# EAGLE design Car (EAGLE 6.2)
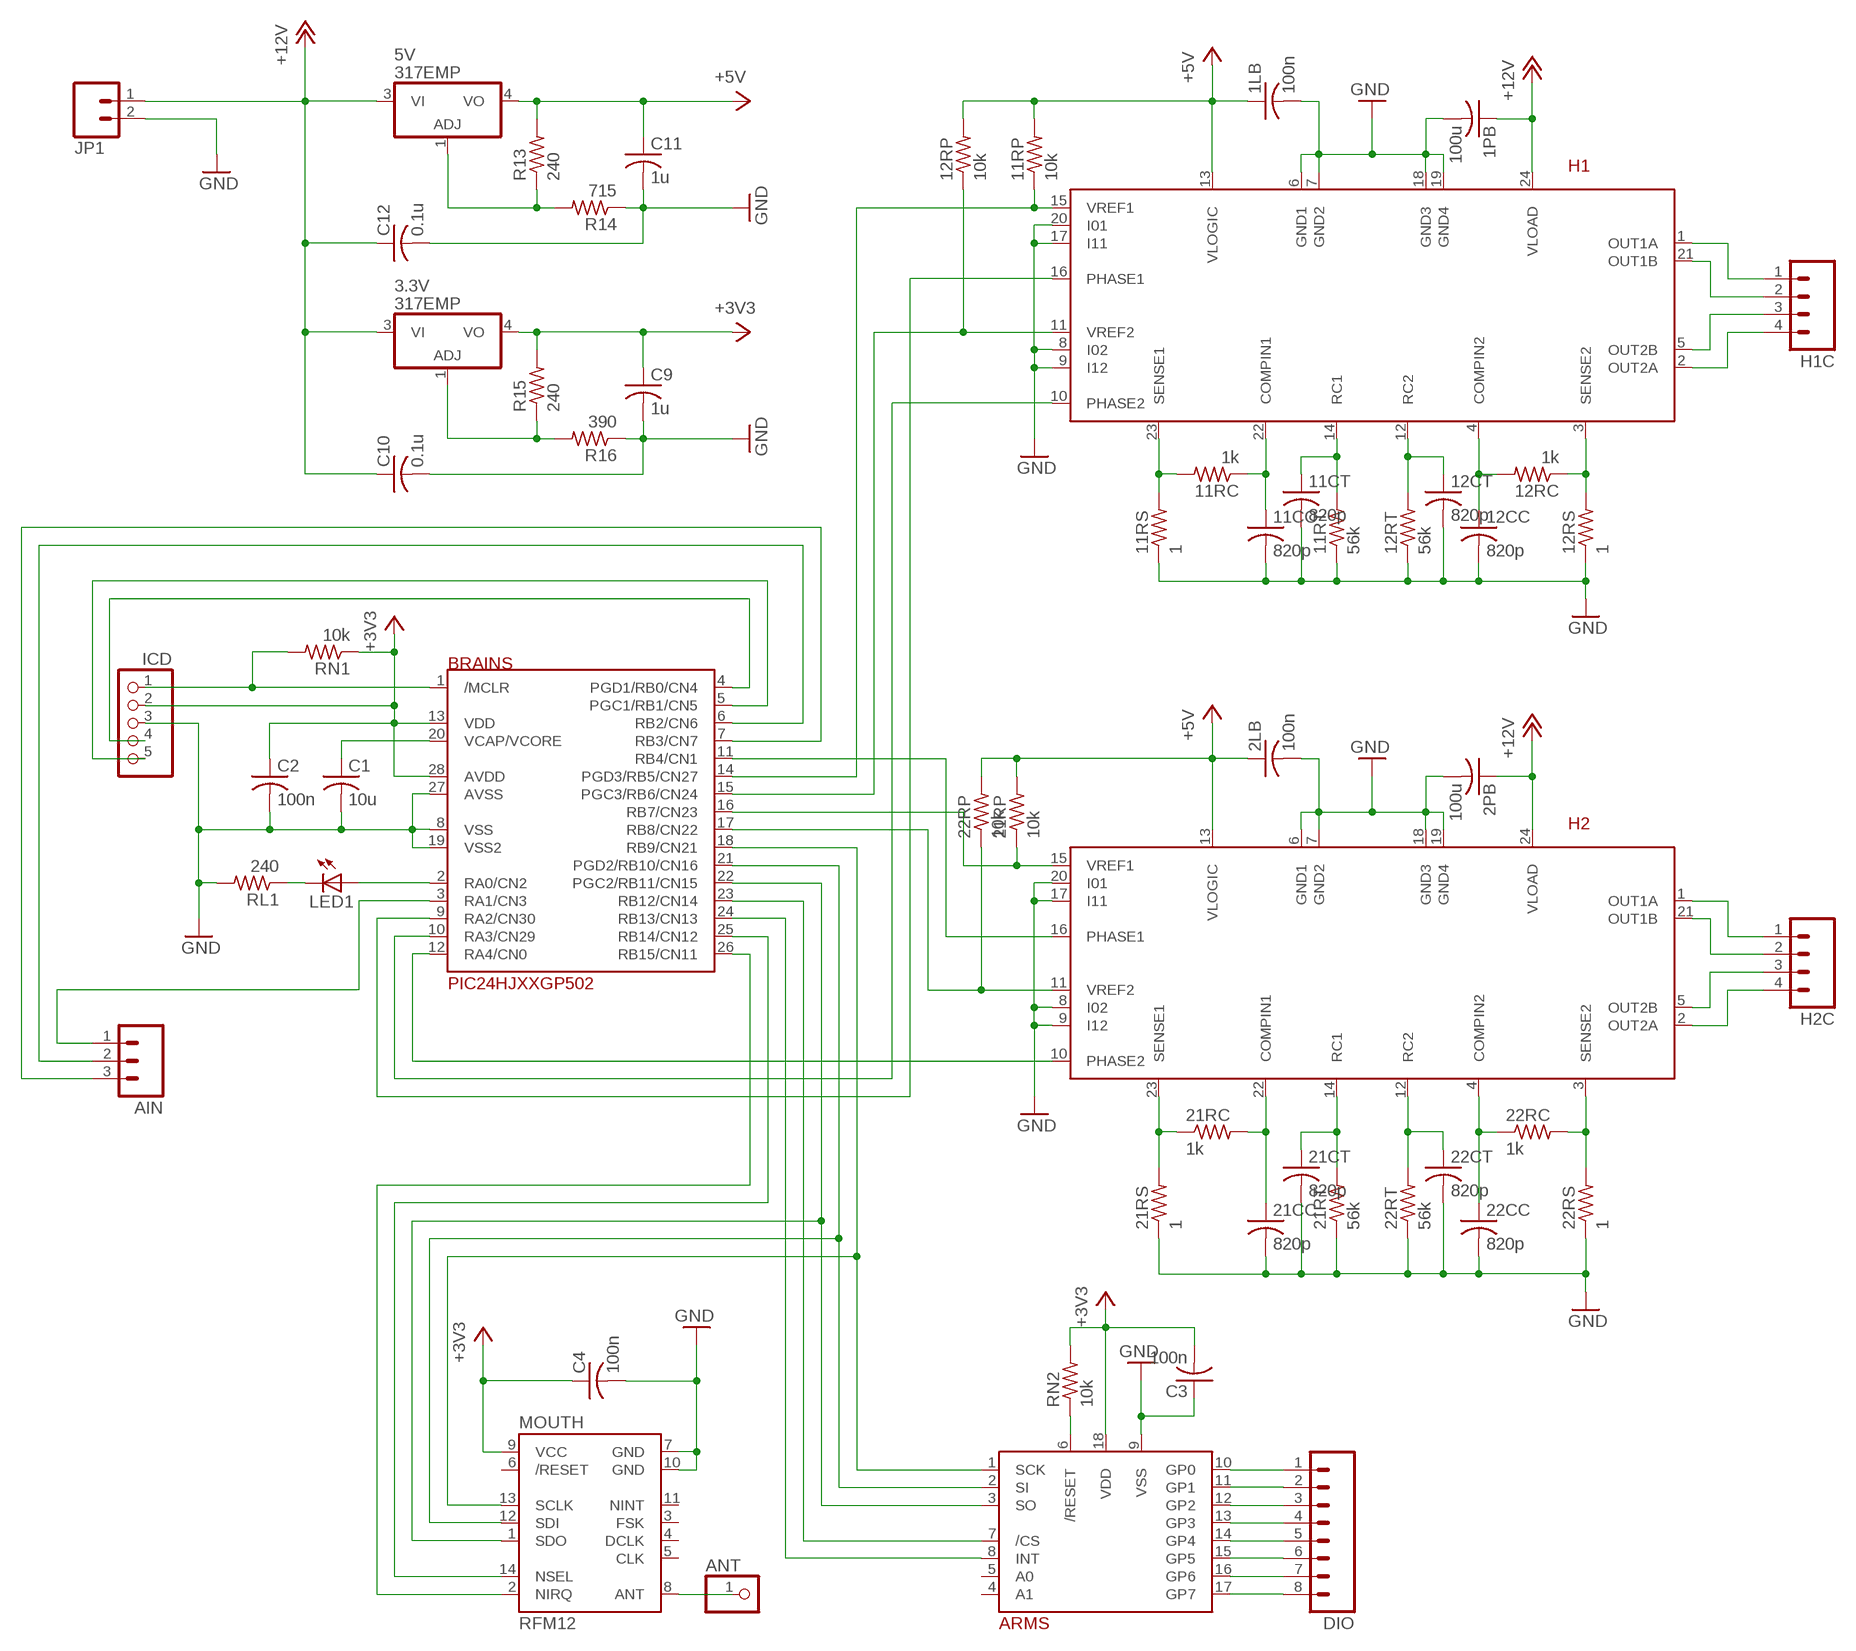
[diagram p0: schematic, sheet 1]

## Parts
1LB  100n  C-USC0805  [C0805]
1PB  100u  C-USC0805  [C0805]
2LB  100n  C-USC0805  [C0805]
2PB  100u  C-USC0805  [C0805]
3.3V  317EMP  [SOT223]
5V  317EMP  [SOT223]
11CC  820p  C-USC0805  [C0805]
11CT  820p  C-USC0805  [C0805]
11RC  1k  R-US_R0805  [R0805]
11RP  10k  R-US_R0805  [R0805]
11RS  1  R-US_R2512  [R2512]
11RT  56k  R-US_R0805  [R0805]
12CC  820p  C-USC0805  [C0805]
12CT  820p  C-USC0805  [C0805]
12RC  1k  R-US_R0805  [R0805]
12RP  10k  R-US_R0805  [R0805]
12RS  1  R-US_R2512  [R2512]
12RT  56k  R-US_R0805  [R0805]
21CC  820p  C-USC0805  [C0805]
21CT  820p  C-USC0805  [C0805]
21RC  1k  R-US_R0805  [R0805]
21RP  10k  R-US_R0805  [R0805]
21RS  1  R-US_R2512  [R2512]
21RT  56k  R-US_R0805  [R0805]
22CC  820p  C-USC0805  [C0805]
22CT  820p  C-USC0805  [C0805]
22RC  1k  R-US_R0805  [R0805]
22RP  10k  R-US_R0805  [R0805]
22RS  1  R-US_R2512  [R2512]
22RT  56k  R-US_R0805  [R0805]
AIN  M03POLAR  [MOLEX-1X3]
ANT  PINHD-1X1  [1X01]
ARMS  MCP23S08  [SO-18W]
BRAINS  PIC24HJXXGP502  [SO28W]
C1  10u  C-USC0805  [C0805]
C2  100n  C-USC0805  [C0805]
C3  100n  C-USC0805  [C0805]
C4  100n  C-USC0805  [C0805]
C9  1u  C-USC0805  [C0805]
C10  0.1u  C-USC0805  [C0805]
C11  1u  C-USC0805  [C0805]
C12  0.1u  C-USC0805  [C0805]
DIO  M081X08  [1X08]
H1  MTS62C19A  [SOP24L]
H1C  M04POLAR  [MOLEX-1X4]
H2  MTS62C19A  [SOP24L]
H2C  M04POLAR  [MOLEX-1X4]
ICD  PINHD-1X5  [1X05]
JP1  M02POLAR  [MOLEX-1X2]
LED1  LEDCHIP-LED0805  [CHIP-LED0805]
MOUTH  RFM12  [RFM12-XXX-S2]
R13  240  R-US_R0805  [R0805]
R14  715  R-US_R0805  [R0805]
R15  240  R-US_R0805  [R0805]
R16  390  R-US_R0805  [R0805]
RL1  240  R-US_R0805  [R0805]
RN1  10k  R-US_R0805  [R0805]
RN2  10k  R-US_R0805  [R0805]

## Nets
+3V3 [power]: 3.3V.4(VO) ARMS.18(VDD) BRAINS.13(VDD) BRAINS.28(AVDD) C2.1 C3.2 C4.1 C9.1 ICD.2 MOUTH.9(VCC) R15.2 RN1.1 RN2.2
+5V [power]: 1LB.1 2LB.1 5V.4(VO) 11RP.2 12RP.2 21RP.2 22RP.2 C11.1 H1.13(VLOGIC) H2.13(VLOGIC) R13.2
+12V [power]: 1PB.1 2PB.1 3.3V.3(VI) 5V.3(VI) C10.1 C12.1 H1.24(VLOAD) H2.24(VLOAD) JP1.1
GND [power]: 1LB.2 1PB.2 2LB.2 2PB.2 11CC.2 11CT.2 11RS.1 11RT.1 12CC.2 12CT.2 12RS.1 12RT.1 21CC.2 21CT.2 21RS.1 21RT.1 22CC.2 22CT.2 22RS.1 22RT.1 ARMS.9(VSS) BRAINS.8(VSS) BRAINS.19(VSS2) BRAINS.27(AVSS) C1.2 C2.2 C3.1 C4.2 C9.2 C10.2 C11.2 C12.2 H1.6(GND1) H1.7(GND2) H1.8(I02) H1.9(I12) H1.17(I11) H1.18(GND3) H1.19(GND4) H1.20(I01) H2.6(GND1) H2.7(GND2) H2.8(I02) H2.9(I12) H2.17(I11) H2.18(GND3) H2.19(GND4) H2.20(I01) ICD.3 JP1.2 MOUTH.7(GND) MOUTH.10(GND) R14.1 R16.1 RL1.2
N$1 [power]: H1.21(OUT1B) H1C.2
N$2 [power]: H1.1(OUT1A) H1C.1
N$3: BRAINS.4(PGD1/RB0/CN4) ICD.4
N$4 [power]: H1.5(OUT2B) H1C.3
N$5 [power]: H1.2(OUT2A) H1C.4
N$6 [power]: H2.21(OUT1B) H2C.2
N$7: ARMS.1(SCK) BRAINS.18(RB9/CN21) MOUTH.13(SCLK)
N$8 [power]: H2.1(OUT1A) H2C.1
N$9 [power]: H2.5(OUT2B) H2C.3
N$10 [power]: H2.2(OUT2A) H2C.4
N$11: BRAINS.1(/MCLR) ICD.1 RN1.2
N$12: ARMS.16(GP6) DIO.7
N$13 [power]: 21RC.1 21RS.2 H2.23(SENSE1)
N$14: 21CC.1 21RC.2 H2.22(COMPIN1)
N$15: 22CT.1 22RT.2 H2.12(RC2)
N$16 [power]: 22RC.2 22RS.2 H2.3(SENSE2)
N$17: 22CC.1 22RC.1 H2.4(COMPIN2)
N$18: 21CT.1 21RT.2 H2.14(RC1)
N$19: 22RP.1 BRAINS.17(RB8/CN22) H2.11(VREF2)
N$20: 3.3V.1(ADJ) R15.1 R16.2
N$21: 12RP.1 BRAINS.15(PGC3/RB6/CN24) H1.11(VREF2)
N$22: BRAINS.25(RB14/CN12) MOUTH.14(NSEL)
N$23: BRAINS.11(RB4/CN1) H2.16(PHASE1)
N$24: BRAINS.26(RB15/CN11) MOUTH.2(NIRQ)
N$25: ARMS.2(SI) BRAINS.21(PGD2/RB10/CN16) MOUTH.12(SDI)
N$26: ARMS.3(SO) BRAINS.22(PGC2/RB11/CN15) MOUTH.1(SDO)
N$27: 5V.1(ADJ) R13.1 R14.2
N$28: BRAINS.5(PGC1/RB1/CN5) ICD.5
N$29: BRAINS.9(RA2/CN30) H1.16(PHASE1)
N$30: 11RP.1 BRAINS.14(PGD3/RB5/CN27) H1.15(VREF1)
N$31 [power]: 11RC.2 11RS.2 H1.23(SENSE1)
N$32: BRAINS.10(RA3/CN29) H1.10(PHASE2)
N$33: 11CC.1 11RC.1 H1.22(COMPIN1)
N$34: 12CC.1 12RC.2 H1.4(COMPIN2)
N$35 [power]: 12RC.1 12RS.2 H1.3(SENSE2)
N$36: ARMS.7(/CS) BRAINS.23(RB12/CN14)
N$37: ARMS.8(INT) BRAINS.24(RB13/CN13)
N$38: 21RP.1 BRAINS.16(RB7/CN23) H2.15(VREF1)
N$39 [power]: ANT.1 MOUTH.8(ANT)
N$40: BRAINS.20(VCAP/VCORE) C1.1
N$41: 11CT.1 11RT.2 H1.14(RC1)
N$42: 12CT.1 12RT.2 H1.12(RC2)
N$43: ARMS.10(GP0) DIO.1
N$44: ARMS.11(GP1) DIO.2
N$45: BRAINS.2(RA0/CN2) LED1.A
N$46: LED1.C RL1.1
N$47: BRAINS.12(RA4/CN0) H2.10(PHASE2)
N$48: ARMS.12(GP2) DIO.3
N$49: ARMS.13(GP3) DIO.4
N$50: ARMS.14(GP4) DIO.5
N$51: ARMS.15(GP5) DIO.6
N$52: ARMS.17(GP7) DIO.8
N$53: AIN.1 BRAINS.3(RA1/CN3)
N$54: AIN.2 BRAINS.6(RB2/CN6)
N$55: AIN.3 BRAINS.7(RB3/CN7)
N$58: ARMS.6(/RESET) RN2.1
Unconnected: ARMS.4(A1) ARMS.5(A0) MOUTH.3(FSK) MOUTH.4(DCLK) MOUTH.5(CLK) MOUTH.6(/RESET) MOUTH.11(NINT)

## Library data of the parts
1LB 1PB 2LB 2PB 11CC 11CT 12CC 12CT 21CC 21CT 22CC 22CT C1-C4 C9-C12 = rcl:C-US: CAPACITOR, American symbol
3.3V 5V = linear:*317: Positive VOLTAGE REGULATOR
11RC 11RP 11RT 12RC 12RP 12RT 21RC 21RP 21RT 22RC 22RP 22RT R13-R16 RL1 RN1 RN2 = rcl:R-US_: RESISTOR, American symbol
11RS 12RS 21RS 22RS = resistor:R-US_: RESISTOR, American symbol
AIN = SparkFun-Connectors:M03: Header 3 Standard 3-pin 0.1" header. Use with straight break away headers (SKU : PRT-00116), right angle break away headers (PRT-00553), swiss pins (PRT-00743), machine pins (PRT-00117), and female headers (PRT-00115). Molex polarized connector foot print use with SKU : PRT-08232 with associated crimp pins and housings.
ANT = pinhead:PINHD-1X1: PIN HEADER
ARMS = microchip:MCP23S08
BRAINS = microchip:PIC24HJXXGP502
DIO = SparkFun-Connectors:M08: Header 8 Standard 8-pin 0.1" header. Use with straight break away headers (SKU : PRT-00116), right angle break away headers (PRT-00553), swiss pins (PRT-00743), machine pins (PRT-00117), and female headers (PRT-00115).
H1 H2 = microchip:MTS62C19A
H1C H2C = SparkFun-Connectors:M04: Header 4 Standard 4-pin 0.1" header. Use with straight break away headers (SKU : PRT-00116), right angle break away headers (PRT-00553), swiss pins (PRT-00743), machine pins (PRT-00117), and female headers (PRT-00115). Molex polarized connector foot print use with SKU : PRT-08231 with associated crimp pins and housings. 1MM SMD Version SKU: PRT-10208
ICD = pinhead:PINHD-1X5: PIN HEADER
JP1 = SparkFun-Connectors:M02: Header 2 Standard 2-pin 0.1" header. Use with straight break away headers (SKU : PRT-00116), right angle break away headers (PRT-00553), swiss pins (PRT-00743), machine pins (PRT-00117), and female headers (PRT-00115). Molex polarized connector foot print use with SKU : PRT-08233 with associated crimp pins and housings.
LED1 = led:LED: LED OSRAM: - CHIPLED LG R971, LG N971, LY N971, LG Q971, LY Q971, LO R971, LY R971 LH N974, LH R974 LS Q976, LO Q976, LY Q976 LO Q996 - Hyper CHIPLED LW Q18S LB Q993, LB Q99A, LB R99A - SideLED LS A670, LO A670, LY A670, LG A670, LP A670 LB A673, LV A673, LT A673, LW A673 LH A674 LY A675 LS A676, LA A676, LO A676, LY A676, LW A676 LS A679, LY A679, LG A679 - Hyper Micro SIDELED® LS Y876, LA Y876, LO Y876, LY Y876 LT Y87S - SmartLED LW L88C, LW L88S LB L89C, LB L89S, LG L890 LS L89K, LO L89K, LY L89K LS L896, LA L896, LO L896, LY L896 - TOPLED LS T670, LO T670, LY T670, LG T670, LP T670 LSG T670, LSP T670, LSY T670, LOP T670, LYG T670 LG T671, LOG T671, LSG T671 LB T673, LV T673, LT T673, LW T673 LH T674 LS T676, LA T676, LO T676, LY T676, LB T676, LH T676, LSB T676, LW T676 LB T67C, LV T67C, LT T67C, LS T67K, LO T67K, LY T67K, LW E67C LS E67B, LA E67B, LO E67B, LY E67B, LB E67C, LV E67C, LT E67C LW T67C LS T679, LY T679, LG T679 LS T770, LO T770, LY T770, LG T770, LP T770 LB T773, LV T773, LT T773, LW T773 LH T774 LS E675, LA E675, LY E675, LS T675 LS T776, LA T776, LO T776, LY T776, LB T776 LHGB T686 LT T68C, LB T68C - Hyper Mini TOPLED® LB M676 - Mini TOPLED Santana® LG M470 LS M47K, LO M47K, LY M47K Source: http://www.osram.convergy.de LUXEON: - LUMILED® LXK2-PW12-R00, LXK2-PW12-S00, LXK2-PW14-U00, LXK2-PW14-V00 LXK2-PM12-R00, LXK2-PM12-S00, LXK2-PM14-U00 LXK2-PE12-Q00, LXK2-PE12-R00, LXK2-PE12-S00, LXK2-PE14-T00, LXK2-PE14-U00 LXK2-PB12-K00, LXK2-PB12-L00, LXK2-PB12-M00, LXK2-PB14-N00, LXK2-PB14-P00, LXK2-PB14-Q00 LXK2-PR12-L00, LXK2-PR12-M00, LXK2-PR14-Q00, LXK2-PR14-R00 LXK2-PD12-Q00, LXK2-PD12-R00, LXK2-PD12-S00 LXK2-PH12-R00, LXK2-PH12-S00 LXK2-PL12-P00, LXK2-PL12-Q00, LXK2-PL12-R00 Source: www.luxeon.com KINGBRIGHT: KA-3528ASYC Source: www.kingbright.com
MOUTH = SparkFun-RF:RFM12

## Net classes
1 power: width 0.508 mm, clearance 0.254 mm

## Board
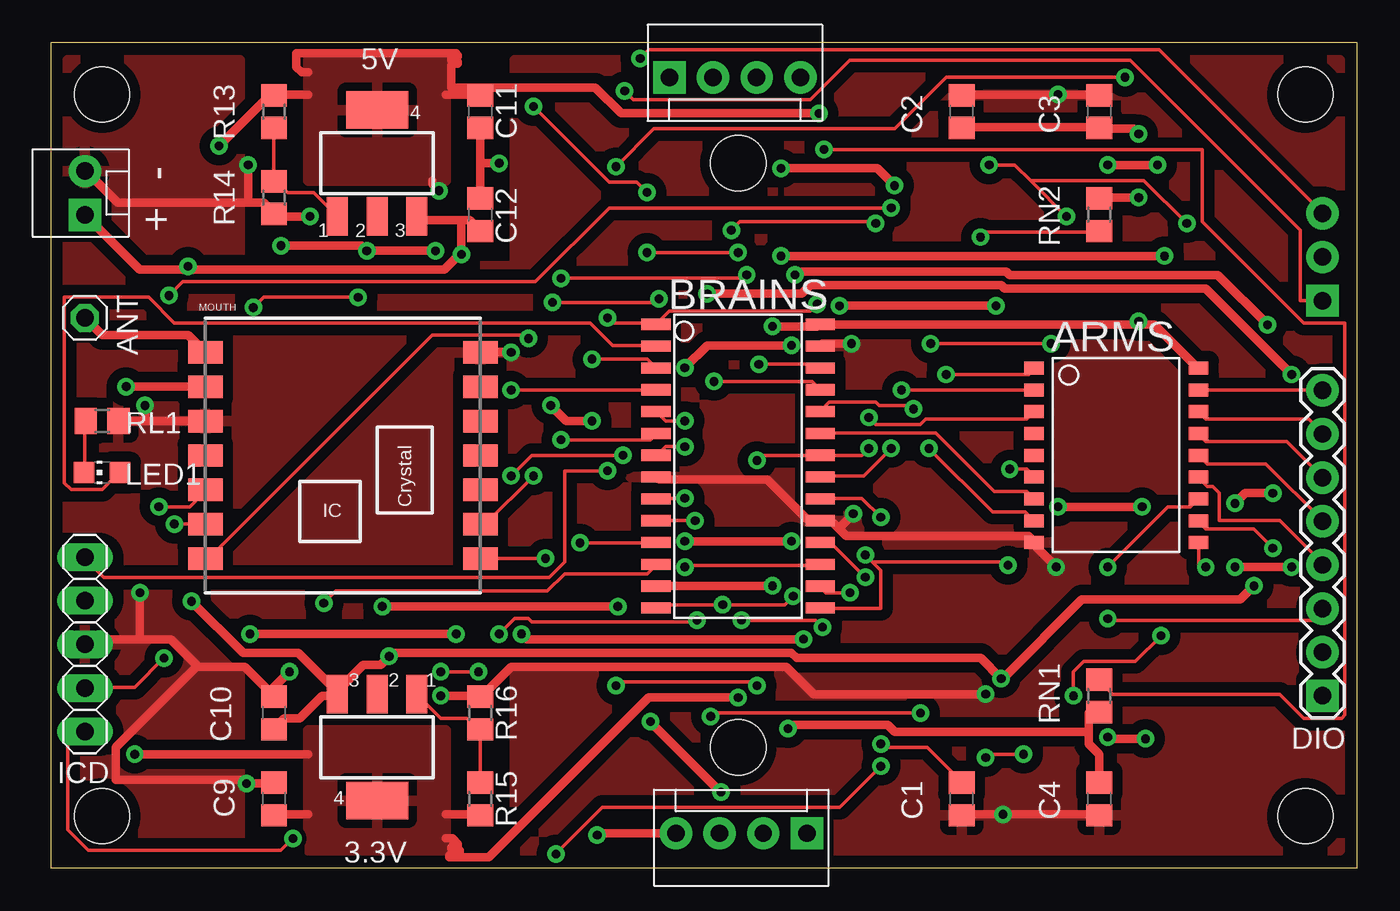
[diagram p1: board, top side]
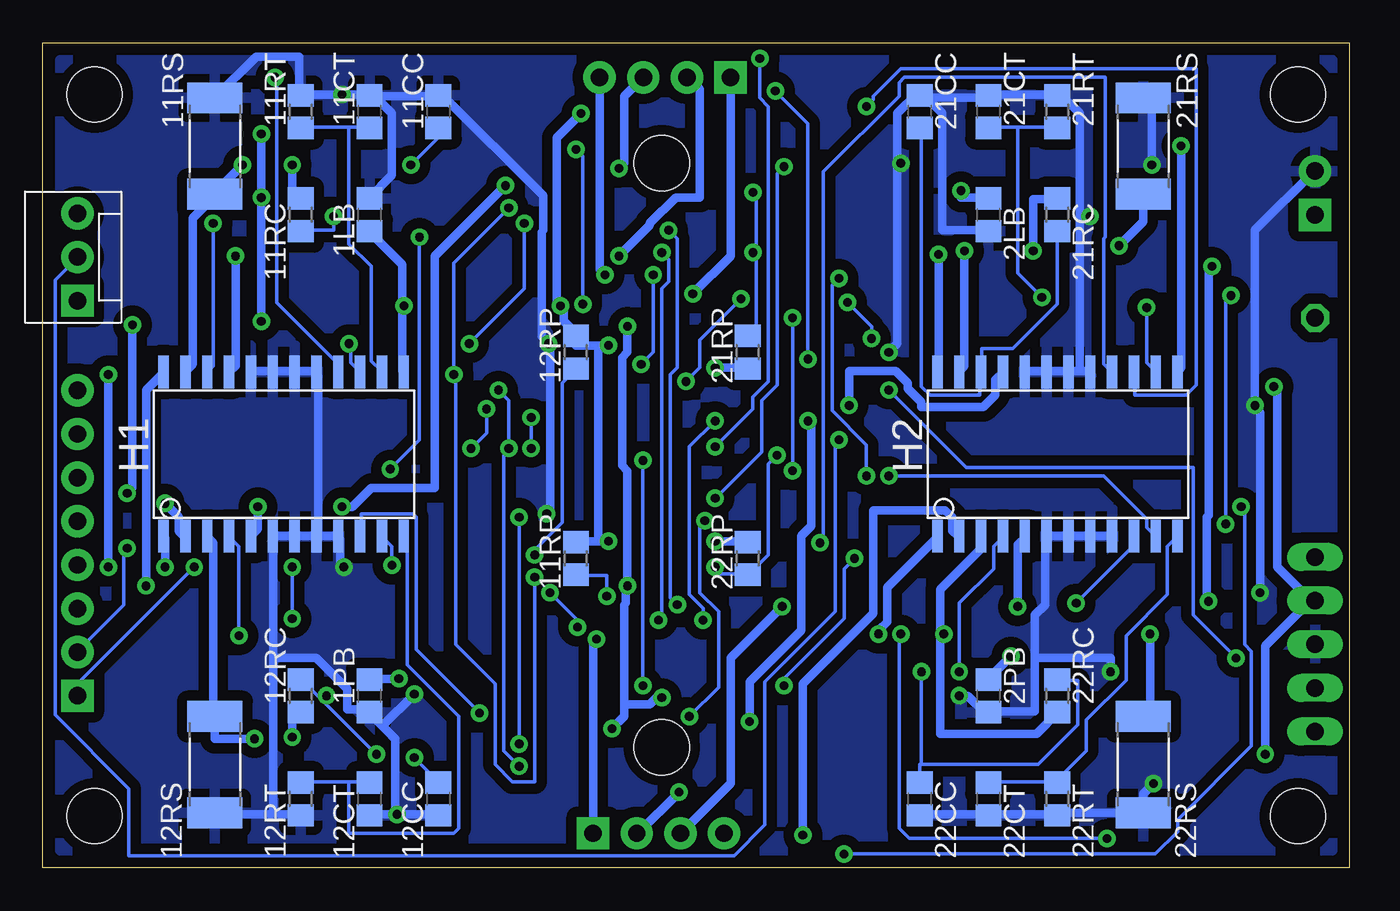
[diagram p2: board, bottom side, seen from below]

Size 76 x 48 mm. Coordinates in mm from the lower left corner, seen from the top.
Outline: 0,0 76,0 76,48 0,48 0,0
Copper layers (1*16): Top 0.035mm / dielectric 1.5mm / Bottom 0.035mm
Design rules: minimum track width 8mil, minimum drill 20mil, track to track 10mil, track to pad 10mil, pad to pad 10mil, via to via 10mil, smd to smd 10mil, copper to edge 10mil, drill to drill 8mil, minimum pad ring 12mil, minimum via ring 10mil, stop-mask expansion 3mil, vias tented up to drill 25mil, thermal gap 20mil
Holes 3.2 mm at 3,45 3,3 40,7 40,41 73,45 73,3
vRestrict: area 10,16 to 26,32; area 15,40 to 23,47; area 15,1 to 23,8

### Footprints (pad centres in the part's own frame; a part is rotated, then mirrored left to right if it is on the bottom)
C0805 = smd 1.3 x 1.5: 1 -0.95,0; 2 0.95,0
SOT223 = smd 1.219 x 2.235: 1 -2.311,-3.099; 2 0,-3.099; 3 2.311,-3.099 | smd 3.6 x 2.2: 4 0,3.099
R0805 = smd 1.3 x 1.5: 1 -0.95,0; 2 0.95,0
R2512 = smd 1.8 x 3.2: 1 -2.8,0; 2 2.8,0
MOLEX-1X3 = drill 1.016 pad 1.88 square: 1 0,0 | drill 1.016 pad 1.88: 2 2.54,0; 3 5.08,0
1X01 = drill 1.016 octagon: 1 0,0
SO-18W = smd 0.762 x 1.143: 1 -5.08,-4.788; 2 -3.81,-4.788; 3 -2.54,-4.788; 4 -1.27,-4.788; 5 0,-4.788; 6 1.27,-4.788; 7 2.54,-4.788; 8 3.81,-4.788; 9 5.08,-4.788; 10 5.08,4.788; 11 3.81,4.788; 12 2.54,4.788; 13 1.27,4.788; 14 0,4.788; 15 -1.27,4.788; 16 -2.54,4.788; 17 -3.81,4.788; 18 -5.08,4.788
SO28W = smd 0.65 x 1.7: 1 -7.62,-4.78; 2 -6.35,-4.78; 3 -5.08,-4.78; 4 -3.81,-4.78; 5 -2.54,-4.78; 6 -1.27,-4.78; 7 0,-4.78; 8 1.27,-4.78; 9 2.54,-4.78; 10 3.81,-4.78; 11 5.08,-4.78; 12 6.35,-4.78; 13 7.62,-4.78; 14 8.89,-4.78; 15 8.89,4.78; 16 7.62,4.78; 17 6.35,4.78; 18 5.08,4.78; 19 3.81,4.78; 20 2.54,4.78; 21 1.27,4.78; 22 0,4.78; 23 -1.27,4.78; 24 -2.54,4.78; 25 -3.81,4.78; 26 -5.08,4.78; 27 -6.35,4.78; 28 -7.62,4.78
1X08 = drill 1.016 pad 1.88 square: 1 0,0 | drill 1.016 pad 1.88: 2 2.54,0; 3 5.08,0; 4 7.62,0; 5 10.16,0; 6 12.7,0; 7 15.24,0; 8 17.78,0
SOP24L = smd 0.6 x 1.9: 1 -6.986,-4.717; 2 -5.716,-4.717; 3 -4.446,-4.717; 4 -3.176,-4.717; 5 -1.906,-4.717; 6 -0.636,-4.717; 7 0.634,-4.717; 8 1.904,-4.717; 9 3.174,-4.717; 10 4.444,-4.717; 11 5.714,-4.717; 12 6.984,-4.717; 13 6.984,4.843; 14 5.714,4.843; 15 4.444,4.843; 16 3.174,4.843; 17 1.904,4.843; 18 0.634,4.843; 19 -0.636,4.843; 20 -1.906,4.843; 21 -3.176,4.843; 22 -4.446,4.843; 23 -5.716,4.843; 24 -6.986,4.843
MOLEX-1X4 = drill 1.016 pad 1.88 square: 1 0,0 | drill 1.016 pad 1.88: 2 2.54,0; 3 5.08,0; 4 7.62,0
1X05 = drill 1.016 long: 1 -5.08,0; 2 -2.54,0; 3 0,0; 4 2.54,0; 5 5.08,0
MOLEX-1X2 = drill 1.016 pad 1.88 square: 1 0,0 | drill 1.016 pad 1.88: 2 2.54,0
CHIP-LED0805 = smd 1.2 x 1.2: A 0,-1.05; C 0,1.05
RFM12-XXX-S2 = smd 2 x 1.3: 1 -8.01,6.01; 2 -8.01,4.01; 3 -8.01,2.01; 4 -8.01,0.01; 5 -8.01,-1.99; 6 -8.01,-3.99; 7 -8.01,-5.99; 8 7.99,-5.99; 9 7.99,-3.99; 10 7.99,-1.99; 11 7.99,0.01; 12 7.99,2.01; 13 7.99,4.01; 14 7.99,6.01

### Placement (x,y rotation side)
1LB  57,38 90 bottom
1PB  57,10 270 bottom
2LB  21,38 270 bottom
2PB  21,10 270 bottom
3.3V  19,7 180 top
5V  19,41 0 top
11CC  53,44 90 bottom
11CT  57,44 90 bottom
11RC  61,38 90 bottom
11RP  45,18 90 bottom
11RS  66,42 270 bottom
11RT  61,44 270 bottom
12CC  53,4 270 bottom
12CT  57,4 270 bottom
12RC  61,10 90 bottom
12RP  45,30 90 bottom
12RS  66,6 90 bottom
12RT  61,4 90 bottom
21CC  25,44 90 bottom
21CT  21,44 90 bottom
21RC  17,38 270 bottom
21RP  35,30 270 bottom
21RS  12,42 270 bottom
21RT  17,44 270 bottom
22CC  25,4 270 bottom
22CT  21,4 270 bottom
22RC  17,10 270 bottom
22RP  35,18 90 bottom
22RS  12,6 90 bottom
22RT  17,4 90 bottom
AIN  74,33 90 bottom
ANT  2,32 270 top
ARMS  62,24 270 top
BRAINS  40,24 270 top
C1  53,4 270 top
C2  53,44 90 top
C3  61,44 270 top
C4  61,4 270 top
C9  13,4 90 top
C10  13,9 90 top
C11  25,44 270 top
C12  25,38 90 top
DIO  74,10 90 top
H1  62,24 0 bottom
H1C  36,46 0 top
H2  16.99,24 0 bottom
H2C  44,2 180 top
ICD  2,13 270 top
JP1  2,38 90 top
LED1  3,23 90 top
MOUTH  17,24 180 top
R13  13,44 90 top
R14  13,39 90 top
R15  25,4 270 top
R16  25,9 270 top
RL1  3,26 0 top
RN1  61,10 90 top
RN2  61,38 90 top

### Tracks (layer width: path | path; a pad name or v marks a point on that pad's centre or on a via)
+3V3  (via drill 0.51)
  Top 0.508: v4.4,28 MOUTH.9 | v63.3,39 61,39 RN2.2 | v63.3,42.7 63,43 61,43 C3.2 60.8,43.1 53,43.1 C2.1 | 15,3.1 13,3.1 C9.1 | 23,3.1 25,3.1 R15.2 | C4.1 61,6.6 60.4,7.2 60.4,7.9 | 60.4,7.9 60.4,9 61,9 RN1.1 | 63.3,31.6 44.8,31.6 BRAINS.28 44.6,31.5 v42,31.5 | 63.3,31.6 64.2,31.6 66.7,29.1 ARMS.18 | v42,16.4 35.3,16.4 BRAINS.13 | 60.4,7.9 49.1,7.9 48.7,8.3 43.1,8.3 v42.9,8.1 | v40,9.9 34.8,9.9 25.5,0.6 23.2,0.6 23.2,0.7 23.4,0.9 23.8,0.9 23.8,1 23.7,1.1 23.3,1.1 23.3,1.2 23.4,1.3 23.7,1.3 23.7,1.4 23.4,1.7 23,1.7 | v63.3,31.8 63.3,31.6 | 15,6.6 v4.9,6.6
  Bottom 0.508: v4.4,28 4.2,27.8 4.2,17.5 2.3,15.6 2,15.6 ICD.2 2.4,15.4 4.9,12.9 v4.9,6.6 | v63.3,42.7 v63.3,39 v63.3,31.8 | v42,31.5 42,30 42.3,29.7 42.3,23.4 42,23.1 v42,16.4 42.1,16.2 42.1,15.4 42.2,15.3 42.2,9.5 | v42.9,8.1 42.2,8.8 42.2,9.5 | v40,9.9 40.3,9.9 40.7,9.5 42.2,9.5
  pour Top: 15,1 15,8 23,8 23,1
+5V  (via drill 0.51)
  Top 0.508: 15,45 13,45 R13.2 12.8,44.8 12.6,44.8 v9.8,42 | v22.6,39.4 22.6,39.6 22.4,39.6 22.2,39.8 22.2,40 | 23,45 25,45 C11.1 | v43.1,19 v36.9,19 | v36.9,29.1 38.2,30.4 v43.1,30.4 | v45.9,32.7 v55,32.7 | v44.7,43.9 33.2,43.9 31.7,45.4 23.3,45.4 23.3,46.7 23.4,46.8 23.7,46.8 23.7,46.9 23.6,47 23.3,47 23.3,47.1 23.4,47.2 23.7,47.2 23.7,47.3 23.6,47.4 14.3,47.4 14.3,46.6 14.6,46.3 15,46.3
  Bottom 0.508: v22.6,39.4 22.6,39 21,39 2LB.1 | v9.8,42 9.8,29.1 10,28.9 H2.13 | 55.1,32.7 55.1,28.9 H1.13 | 55.1,32.7 55.1,35.1 57,37 1LB.1 | v36.9,19 35,19 22RP.2 | 43.7,19 45,19 11RP.2 | 43.7,19 v43.1,19 | v36.9,29.1 35,29.1 21RP.2 | 43.7,30.4 45,30.4 12RP.2 45.1,31.2 45.7,31.8 45.7,32.5 v45.9,32.7 46.1,32.8 46.1,42.5 v44.7,43.9 | 43.7,30.4 v43.1,30.4 | 43.7,30.4 43.7,19 | v55,32.7 55.1,32.7
  pour Top: 15,47 15,40 23,40 23,47
+12V  (via drill 0.51)
  Top 0.508: 23.9,37.7 21.6,37.7 21.4,37.9 5V.3 | 23.9,37.7 24.4,37.7 25,37.1 C12.1 | 23.9,37.7 v23.9,35.7 23.7,35.6 22.9,34.8 8,34.8 | JP1.1 5.2,34.8 8,34.8 | C10.1 13,8.1 13.6,8.7 14.5,8.7 15.8,10 16.6,10 3.3V.3 | 3.3V.3 16.7,10.3 18.2,11.8 19.2,11.8 v19.7,12.3 19.8,12.5 43.1,12.5 43.4,12.2 54.1,12.2 v55.3,11 55.5,11.1 60,15.6 69.2,15.6 v70,16.4 | v8.2,15.5 11.2,12.5 14.4,12.5 16.5,10.4 3.3V.3 | v8,35 8,34.8
  Bottom 0.508: v23.9,35.7 23.9,28.9 H2.24 | v19.7,12.3 21,11 2PB.1 | v55.3,11 57,11 1PB.1 | v70,16.4 70,27.8 69,28.8 H1.24 | v8,35 8.2,34.8 8.2,20.5 8.3,20.4 8.3,15.6 v8.2,15.5
GND  (via drill 0.51)
  Top 0.508: v22.7,10 25,10 R16.1 25.2,10.1 26.8,11.7 42.8,11.7 44.4,10.1 v54.4,10.1 | 8.6,11.7 11.3,11.7 13,10 C10.2 12.9,10.4 v13.9,11.4 | 8.6,11.7 7,13.3 5.2,13.3 | 5.2,13.3 2.3,13.3 ICD.3 | C9.2 13,4.9 v11.4,4.9 11.3,5.1 3.8,5.1 3.8,7 8.4,11.6 8.6,11.7 | C11.2 25,41 | 25,41 C12.2 | v26.8,30 25.1,30 MOUTH.7 | v26.1,41 25,41 | 5.5,26 MOUTH.10 | 5.5,26 RL1.2 | 11.5,38.7 3.9,38.7 2.1,40.5 2,40.5 JP1.2 | 11.5,38.7 12.4,38.7 13,38.1 R14.1 13.2,37.9 v15.1,37.9 | 11.5,38.7 v11.5,40.9 | v5.5,26.9 5.5,26 | v5.2,16 5.2,13.3 | 11CC.2 53,45 v58.6,45 61,45 11RT.1 | v46.6,30.5 44.9,30.5 44.8,30.4 BRAINS.27 | 45.85,19.75 45.5,20.1 44.8,20.1 BRAINS.19 44.6,20.3 44,20.3 41.7,22.6 35.4,22.6 35.3,22.7 BRAINS.8 | 45.85,19.75 46.3,19.3 56.9,19.3 57.2,19 ARMS.9 57.3,18.7 v58.5,17.5 | 12CC.2 53,3.1 v55.4,3.1 61,3.1 12RT.1 | 45.85,19.75 v46.7,20.6
  Bottom 0.508: H2.9 13.9,19.3 15,19.3 H2.8 15.3,19.3 16.1,19.3 H2.7 16.4,19.3 17.4,19.3 H2.6 17.7,19.2 17.7,15.3 18.3,14.7 18.3,12.2 | 18.3,12.2 18.3,9.1 21,9.1 2PB.2 21.2,9 22.2,10 v22.7,10 | v11.4,4.9 12,4.3 22RS.1 16.8,3.2 22RT.1 17,3.1 21,3.1 22CT.2 21.2,3.1 25,3.1 22CC.2 | 18.3,12.2 13.9,12.2 v13.9,11.4 | 15.7,28.9 16.3,28.9 H2.18 16.6,28.9 17.6,28.9 H2.19 17.8,28.9 18.8,28.9 H2.20 | 15.7,28.9 15.1,28.9 H2.17 | 2LB.2 21,37.1 23.7,37.1 23.7,43.9 24.7,44.9 25,44.9 21CC.2 | v26.8,30 26.3,30.5 26.3,41 | 26.3,41 26.3,43.9 25.2,45 21CC.2 | 21CC.2 24.3,44.8 21.2,44.8 21CT.2 21,45 17,45 21RT.1 16.8,45 15.7,43.9 15.7,37.9 | v26.1,41 26.3,41 | 15.7,37.9 15.7,28.9 | 21RS.1 11.5,44.3 v11.5,40.9 | JP1.2 2,40.6 5.5,37.1 v5.5,26.9 5.4,26.7 5.2,26.5 v5.2,16 | v15.1,37.9 15.7,37.9 | 1LB.2 57,39 55.7,40.3 55.7,43.9 56.7,44.9 57,44.9 11CT.2 | 11CT.2 56.4,44.9 53,44.9 11CC.2 52.8,45 46.9,39.1 46.9,37.1 47,37 47,30.9 v46.6,30.5 46.5,30.3 46.5,20.8 v46.7,20.6 | 11CT.2 57.2,45 v58.6,45 61,45 11RT.1 61.1,45.2 61.1,47.2 63.6,47.2 11RS.1 | 55.5,3.1 57,3.1 12CT.2 | 55.5,3.1 v55.4,3.1 53,3.1 12CC.2 | 56.25,8.25 55.5,7.5 55.5,3.1 | 56.25,8.25 57,9 1PB.2 57.2,9.2 58.3,9.2 58.3,10.4 60.1,12.2 62.6,12.2 | 62.6,3.1 66,3.1 12RS.1 | 62.6,3.1 61,3.1 12RT.1 | H1.8 60,19.3 58.9,19.3 H1.9 58.7,19.1 58.7,17.7 v58.5,17.5 | H1.8 60.3,19.3 61.3,19.3 H1.7 61.6,19.3 62.6,19.3 H1.6 62.6,19.1 62.6,12.2 | H1.20 63.9,28.9 62.9,28.9 H1.19 62.6,28.9 61.6,28.9 H1.18 61.3,28.9 60.1,28.9 H1.17 60,28.6 60,19.5 H1.8 | 62.6,12.2 62.6,3.1 | 56.25,8.25 v54.4,10.1
  pour Top (isolate 0.61): 1,47 11,47 11,35 27,35 27,47 75,47 75,1 27,1 27,13 11,13 11,1 1,1
  pour Bottom (isolate 0.61): 1,47 75,47 75,1 1,1
N$1  (via drill 0.51)
  Top 0.508: v42.5,35.6 v64.8,35.6
  Bottom 0.508: v64.8,35.6 64.8,29.2 65.1,28.9 H1.21 | v42.5,35.6 40.7,37.4 40.7,37.5 39.2,39 37.8,39 37.8,45.3 38.5,46 H1C.2
N$2  (via drill 0.51)
  Top 0.508: v72.2,17.5 v68.9,17.5 | v72.2,28.7 67.2,33.7 55.5,33.7 55.3,33.9 44.2,33.9 43.7,33.4 v38.2,33.4
  Bottom 0.508: v68.9,17.5 68.9,19.2 H1.1 | v72.2,28.7 v72.2,17.5 | v38.2,33.4 36,35.6 H1C.1
N$3  (via drill 0.51)
  Top 0.203: v26.8,27.8 35.2,27.8 BRAINS.4 | v6.6,12.2 4.9,10.5 2,10.5 ICD.4
  Bottom 0.203: v26.8,27.8 22.3,23.3 9.1,23.3 9.1,14.7 v6.6,12.2
N$4  (via drill 0.51)
  Top 0.508: v58.6,21 v63.5,21 | v49.1,39.7 48.1,40.7 v42.5,40.7
  Bottom 0.508: v63.5,21 63.5,19.7 63.9,19.3 H1.5 | v58.6,21 58,21 56.9,22.1 53.2,22.1 53.2,35.6 v49.1,39.7 | v42.5,40.7 42.2,41 42.2,44.9 41.1,46 H1C.3
N$5  (via drill 0.51)
  Top 0.508: v68.9,21.2 69.5,21.8 v71.1,21.8 | v70.8,31.6 67.9,34.5 55.8,34.5 55.6,34.7 43.5,34.7 v43.3,34.5
  Bottom 0.508: v68.9,21.2 68.1,20.4 68.1,19.6 67.8,19.3 H1.2 | v71.1,21.8 70.8,22.1 v70.8,31.6 | v43.3,34.5 43.6,34.8 43.6,46 H1C.4
N$6  (via drill 0.51)
  Top 0.508: v29.1,26.9 30,26 v31.5,26 | v39,4.4 v34.9,8.5
  Bottom 0.508: v29.1,26.9 29.1,28.9 26.4,28.9 25.7,28.2 25.7,27.9 24.9,27.1 24.9,26.8 21.3,26.8 20.6,27.5 20.6,28.4 20.2,28.8 H2.21 | v31.5,26 31.3,25.8 31.3,19.9 31.9,19.3 31.9,13.8 34.9,10.8 v34.9,8.5 | v39,4.4 41.4,2 H2C.2
N$7  (via drill 0.51)
  Top 0.203: v52.1,28.7 56.9,28.7 57.2,29 ARMS.1 | v47.4,16.9 45.4,18.9 44.8,18.9 BRAINS.18 | v7.2,20 MOUTH.13 | v6.9,33.3 7.7,34.1 28.2,34.1 32.5,38.4 v48.9,38.4
  Bottom 0.203: v47.4,16.9 47.4,5 48.7,5 49.7,6 49.7,10.7 52,13 52,28.6 v52.1,28.7 52.1,35.2 v48.9,38.4 | v7.2,20 7.2,33 v6.9,33.3
N$8  (via drill 0.51)
  Top 0.508: v27.4,13.6 27.7,13.3 v43.8,13.3
  Bottom 0.508: v27.4,13.6 27.4,13.8 26.9,14.3 26.9,16.3 24,19.2 H2.1 | v43.8,13.3 44,13.1 H2C.1
N$9  (via drill 0.51)
  Top 0.508: v33,15.2 v19.3,15.2
  Bottom 0.508: v19.3,15.2 19.3,18.8 18.9,19.2 H2.5 | v33,15.2 36,12.2 36,4.9 38.9,2 H2C.3
N$10  (via drill 0.51)
  Top 0.508: v31.8,1.9 31.9,2 H2C.4
  Bottom 0.508: v31.8,1.9 31.8,10.7 27.7,14.8 27.7,20.8 23.5,20.8 23.1,20.4 23.1,19.6 22.8,19.3 H2.2
N$11  (via drill 0.51)
  Top 0.203: v45,41.8 67,41.8 67,37.6 72.9,31.7 75.3,31.7 75.3,8.9 75.1,8.7 72.9,8.7 71.5,10.1 61.8,10.1 61,10.9 RN1.2 | v44.6,32.8 44.2,32.4 36,32.4 BRAINS.1 35.2,31.7 32.7,31.7 v32.4,32 | v32.4,23.1 29.9,23.1 29.9,17.8 29,16.9 3.1,16.9 2,18 ICD.1
  Bottom 0.203: v45,41.8 44.6,41.4 v44.6,32.8 | v32.4,32 v32.4,23.1
N$12
  Top 0.203: ARMS.16 66.8,26.5 67.2,26.1 73.2,26.1 74,25.3 DIO.7
N$13  (via drill 0.51)
  Top 0.508: v13.4,36.2 18.1,36.2 v18.4,35.9 v22.4,35.9
  Bottom 0.508: v18.4,35.9 18.4,38.9 17,38.9 21RC.1 | v13.4,36.2 12,37.6 21RS.2 | v22.4,35.9 22.4,29.2 22.7,28.9 H2.23
N$14
  Bottom 0.203: 21RC.2 17,32.8 19.6,30.2 21.4,30.2 21.4,28.9 H2.22 21.5,28.8 21.5,27.5 24.4,27.5 24.9,28 24.9,42.9 25,43 21CC.1
N$15
  Bottom 0.203: 22CT.1 21,5 17,5 22RT.2 17,5.1 15.3,6.8 15.3,8.6 13,10.9 13,13.5 10.6,15.9 10.6,18.7 10.1,19.2 H2.12
N$16  (via drill 0.51)
  Top 0.508: v23.6,13.6 v11.6,13.6
  Bottom 0.508: 23.8,13.6 23.8,16.2 21.5,18.5 21.5,19.2 H2.3 | 23.8,13.6 23.8,7.8 18.2,7.8 17,9 22RC.2 | 22RS.2 11.6,9.2 v11.6,13.6 | v23.6,13.6 23.8,13.6
N$17  (via drill 0.51)
  Top 0.203: v24.9,11.4 v22.7,11.4
  Bottom 0.203: 24.9,6 25,6 22CC.1 | 24.9,6 18.1,6 15.8,8.3 15.8,10.9 17,10.9 22RC.1 | v22.7,11.4 22.7,15.4 20.7,17.4 20.7,18.7 20.2,19.2 H2.4 | 24.9,6 v24.9,11.4
N$18  (via drill 0.51)
  Top 0.203: v11.8,32.6 12.4,33.2 v17.9,33.2
  Bottom 0.203: 19.3,43.1 21,43.1 21CT.1 | 19.3,43.1 17,43.1 21RT.2 | v11.8,32.6 11.8,29.4 11.3,28.9 H2.14 | v17.9,33.2 19.3,34.6 19.3,43.1
N$19  (via drill 0.51)
  Top 0.203: v36.9,17.5 37,17.6 44.7,17.6 BRAINS.17 | v26.8,22.8 28,24 v33.3,24
  Bottom 0.203: v36.9,17.5 36.9,17.1 35,17.1 22RP.1 34.9,17.1 33.8,18.2 33.8,23.5 v33.3,24 | v26.8,22.8 14.3,22.8 11.8,20.3 11.8,19.8 11.3,19.3 H2.11
N$20
  Top 0.203: R15.1 R16.2 24.9,8 24.2,8.7 22.7,8.7 21.4,10 3.3V.1
N$21  (via drill 0.51)
  Top 0.203: 47.85,17.75 48.3,17.3 48.3,15.1 44.8,15.1 BRAINS.15 | 47.85,17.75 v47.4,18.2 | v55.7,17.6 55.5,17.8 47.9,17.8 47.85,17.75
  Bottom 0.203: v47.4,18.2 47.4,18.5 45.8,20.1 45.8,28.2 45,29 12RP.1 | v55.7,17.6 55.7,18.7 56.2,19.2 H1.11
N$22  (via drill 0.51)
  Top 0.203: v38.6,28.3 44.3,28.3 44.7,27.9 BRAINS.25 | v35.4,33.1 35.2,32.9 v29.2,32.9 | v27.8,30.8 27.6,31 22.2,31 9.2,18 9.1,18 MOUTH.14
  Bottom 0.203: v38.6,28.3 37.8,29.1 37.8,30.7 v35.4,33.1 | v29.2,32.9 27.8,31.5 v27.8,30.8
N$23  (via drill 0.51)
  Top 0.203: v30.8,18.9 35.2,18.9 BRAINS.11
  Bottom 0.203: v30.8,18.9 30.6,19.1 30.6,40.5 26.2,44.9 26.2,45.7 25.9,46 14.2,46 14.2,36.7 14.3,36.6 14.3,29.3 13.9,28.9 H2.16
N$24  (via drill 0.51)
  Top 0.203: v41.2,29.3 44.5,29.3 44.7,29.1 BRAINS.26 | v40.5,34.5 40.3,34.3 v29.7,34.3 | v28.1,22.8 25.3,20 25.1,20 MOUTH.2
  Bottom 0.203: v41.2,29.3 40.5,30 v40.5,34.5 | v29.7,34.3 30.1,33.9 30.1,26.6 28.1,24.6 v28.1,22.8
N$25  (via drill 0.51)
  Top 0.203: v49.5,27.8 ARMS.2 | v48.9,24.4 47.3,22.8 44.8,22.8 BRAINS.21 | v6.3,21 8.1,21 9,21.9 MOUTH.12 | v29.4,0.8 32.1,3.5 45.9,3.5 v48.3,5.9
  Bottom 0.203: v49.5,27.8 48.9,27.2 v48.9,24.4 48.9,24.3 49.2,24 49.2,6.8 v48.3,5.9 | v6.3,21 6.1,20.8 6.1,13 5.7,12.6 5.7,7.1 10,2.8 10,2.1 11.3,0.8 v29.4,0.8
N$26  (via drill 0.51)
  Top 0.203: v47.6,26.2 48,25.8 50.6,25.8 50.9,26.1 56.8,26.1 57.2,26.5 ARMS.3 | v47.6,24.4 47.2,24 BRAINS.22 41.4,24 v41.1,23.7 | v28.8,18 25.1,18 MOUTH.1 | v32.9,10.6 33.1,10.8 40.9,10.8 v41.1,10.6
  Bottom 0.203: v47.6,24.4 v47.6,26.2 | v28.8,18 29.4,17.4 29.4,14.5 32.9,11 v32.9,10.6 | v41.1,23.7 v41.1,10.6
N$27
  Top 0.203: R13.1 R14.2 13.1,40 13.8,39.3 15.3,39.3 16.6,38 5V.1
N$28  (via drill 0.51)
  Top 0.203: v36.9,26 35.8,26 35.3,26.5 BRAINS.5 | v37.6,14.4 37.5,14.3 28,14.3 27.8,14.5 27,14.5 v26.1,13.6 | v14.1,1.7 13.4,1 2.2,1 1,2.2 1,7.9 2,7.9 ICD.5
  Bottom 0.203: v36.9,26 38.4,24.5 38.4,15.9 37.6,15.1 v37.6,14.4 | v26.1,13.6 26.2,13.5 26.2,2.3 25.6,1.7 v14.1,1.7
N$29  (via drill 0.51)
  Top 0.203: v36.9,21.5 35.3,21.5 BRAINS.9 | v32.9,40.8 35.1,43 49.1,43 52.1,46 v62.5,46
  Bottom 0.203: v36.9,21.5 34.2,24.2 34.2,27.2 33.3,28.1 33.3,40.4 v32.9,40.8 | v62.5,46 62.4,45.9 62.4,32.9 58.9,29.4 58.9,28.9 H1.16
N$30  (via drill 0.51)
  Top 0.203: v43.2,15.8 42.7,15.3 v39.1,15.3 35.4,15.3 35.3,15.2 BRAINS.14 | v51.2,30.5 v58.2,30.5 | v48,37.5 47.9,37.6 40.1,37.6 v39.6,37.1
  Bottom 0.203: v43.2,15.8 43.2,17 45,17 11RP.1 | v58.2,30.5 58.1,30.4 58.1,29.4 57.6,28.9 H1.15 | v51.2,30.5 48,33.7 v48,37.5 | v39.6,37.1 39.1,36.6 39.1,29.1 39.5,28.7 39.5,15.7 v39.1,15.3
N$31  (via drill 0.51)
  Top 0.508: v64.4,40.9 v61.5,40.9
  Bottom 0.508: v61.5,40.9 61.5,39.5 61,39 11RC.2 | v64.4,40.9 66,39.3 11RS.2 66.1,39 67.3,37.8 67.3,29.3 67.7,28.9 H1.23
N$32  (via drill 0.51)
  Top 0.203: v37.5,20.2 35.3,20.2 BRAINS.10 | v38.4,8.8 38.6,9 v50.6,9
  Bottom 0.203: v37.5,20.2 37.8,19.9 37.8,16 36.7,14.9 36.7,10.5 v38.4,8.8 | v50.6,9 54.3,12.7 54.3,20.4 54.5,20.6 57.5,20.6 57.5,19.3 H1.10
N$33  (via drill 0.51)
  Top 0.203: 57.05,39.95 56.1,40.9 v54.6,40.9 | 57.05,39.95 v59.1,37.9 | v66.1,37.5 63.6,40 57.1,40 57.05,39.95
  Bottom 0.203: v59.1,37.9 59.1,37.1 61,37.1 11RC.1 | v54.6,40.9 53,42.5 11CC.1 | v66.1,37.5 66.1,29.2 66.4,28.9 H1.22
N$34  (via drill 0.51)
  Top 0.203: v54.4,6.4 54.6,6.6 v56.6,6.6 | v64.6,13.5 63.1,12 60.1,12 59.5,11.4 v59.5,10
  Bottom 0.203: v54.4,6.4 53,5 12CC.1 | 59.75,9.75 61,11 12RC.2 | 59.75,9.75 v56.6,6.6 | v64.6,13.5 64.6,18.7 65.1,19.2 H1.4 | 59.75,9.75 v59.5,10
N$35  (via drill 0.51)
  Top 0.508: v61.5,7.6 61.6,7.5 v63.7,7.5
  Bottom 0.508: v61.5,7.6 61.5,8.5 61,9 12RC.1 | v63.7,7.5 66,7.5 12RS.2 66.1,9 66.1,18.9 66.4,19.2 H1.3
N$36
  Top 0.203: ARMS.7 57.2,21.5 56.8,21.9 54.9,21.9 51.5,25.3 44.8,25.3 BRAINS.23
N$37  (via drill 0.51)
  Top 0.203: v51.1,24.4 54.8,20.7 56.7,20.7 ARMS.8 | v50.2,26.7 50,26.9 48.2,26.9 48,27.1 45.3,27.1 44.8,26.6 BRAINS.24
  Bottom 0.203: v51.1,24.4 50.2,25.3 v50.2,26.7
N$38  (via drill 0.51)
  Top 0.203: v34.7,39.3 34.1,39.9 32.5,39.9 v28.1,44.3 | v46.5,16 45.1,16 44.8,16.3 BRAINS.16 | v44.9,14 44.5,14.4 v40.2,14.4 | v34.7,35.8 v40,35.8
  Bottom 0.203: 34.5,35.8 34.5,39.1 v34.7,39.3 | 34.5,35.8 34.5,31.5 35,31 21RP.1 | v28.1,44.3 27.7,44.7 27.7,44.9 26.1,46.5 8.9,46.5 8.9,28.1 9.5,27.5 12.5,27.5 12.5,28.8 H2.15 | v46.5,16 44.9,14.4 v44.9,14 | v40.2,14.4 40,14.6 40,33.7 39.6,34.1 39.6,35.4 v40,35.8 | v34.7,35.8 34.5,35.8
N$39
  Top 0.508: MOUTH.8 8,31 3,31 ANT.1
N$40  (via drill 0.51)
  Top 0.203: v48.3,7.2 48.5,7 51,7 53,5 C1.1 | v48.3,20.4 47.2,21.5 44.8,21.5 BRAINS.20
  Bottom 0.203: v48.3,20.4 v48.3,7.2
N$41
  Bottom 0.203: 58.2,43.1 61,43.1 11RT.2 | 58.2,43.1 57,43.1 11CT.1 | 58.2,43.1 58.2,36.3 56.9,35 56.9,29.5 56.3,28.9 H1.14
N$42
  Bottom 0.203: 58.2,5 61,5 12RT.2 | 58.2,5 57,5 12CT.1 | 58.2,5 58.2,2 52.1,2 51.8,2.3 51.8,8.8 54.8,11.8 54.8,19 55,19.2 H1.12
N$43  (via drill 0.51)
  Top 0.203: v67.2,17.5 66.8,17.5 66.8,18.9 ARMS.10
  Bottom 0.203: v67.2,17.5 74,10.7 DIO.1
N$44  (via drill 0.51)
  Top 0.203: v71.1,18.6 70,19.7 67.2,19.7 66.8,20.1 ARMS.11
  Bottom 0.203: v71.1,18.6 71.3,18.4 71.3,15.3 74,12.6 DIO.2
N$45
  Top 0.203: LED1.A 4,23 3,22 1.2,22 0.8,22.4 0.8,33.2 5.7,33.2 7.2,31.7 31.4,31.7 32.7,30.4 35.2,30.4 BRAINS.2
N$46
  Top 0.203: LED1.C 2,23 2,26 RL1.1
N$47  (via drill 0.51)
  Top 0.203: v15.9,15.4 16.6,16.1 28.9,16.1 29.9,17.1 34.7,17.1 35.2,17.6 BRAINS.12
  Bottom 0.203: v15.9,15.4 12.6,18.7 12.6,19.2 H2.10
N$48  (via drill 0.51)
  Top 0.203: v61.5,17.5 65,21 66.3,21 66.7,21.4 ARMS.12 | v61.5,14.5 61.6,14.4 73.4,14.4 74,15 DIO.3
  Bottom 0.203: v61.5,14.5 v61.5,17.5
N$49
  Top 0.203: ARMS.13 66.8,22.7 67.3,22.2 67.6,22.2 68,21.8 68,20.2 71.5,20.2 74,17.7 DIO.4
N$50
  Top 0.203: ARMS.14 67.3,23.5 70.7,23.5 74,20.2 DIO.5
N$51
  Top 0.203: DIO.6 71.9,24.8 67.2,24.8 66.8,25.2 ARMS.15
N$52
  Top 0.203: ARMS.17 74,27.8 DIO.8
N$53  (via drill 0.51)
  Top 0.203: BRAINS.3 34.7,29.6 v31.5,29.6 | v33.4,45.2 33.9,44.7 44.2,44.7 46.5,47 62.8,47 72.7,37.1 72.7,33 AIN.1
  Bottom 0.203: v31.5,29.6 31.5,43.3 v33.4,45.2
N$54  (via drill 0.51)
  Top 0.203: v29.7,24.9 34.9,24.9 35.2,25.2 BRAINS.6
  Bottom 0.203: v29.7,24.9 29.9,24.7 29.9,14.9 34,10.8 34,2.5 35.8,0.7 71,0.7 71,4.6 75.3,8.9 75.3,34.2 74,35.5 AIN.2
N$55  (via drill 0.51)
  Top 0.203: v36.9,24.5 35.8,24.5 35.3,24 BRAINS.7 | v34.3,47.1 34.8,47.6 64.5,47.6 74,38.1 AIN.3
  Bottom 0.203: v36.9,24.5 34.7,26.7 34.7,27.4 33.8,28.3 33.8,44.3 34.3,44.8 v34.3,47.1
N$58  (via drill 0.51)
  Top 0.203: v55.8,23.2 56.8,23.2 57.2,22.8 ARMS.6 | v54.1,36.7 54.4,37 61,37 RN2.1
  Bottom 0.203: v55.8,23.2 54.1,24.9 v54.1,36.7

### Text on the board
tPlace: - | +
_tsilk: MCLR | 3.3v | GND | PGD | PGC